# Altium schematic sheet BLE-2541.SchDoc
size A3
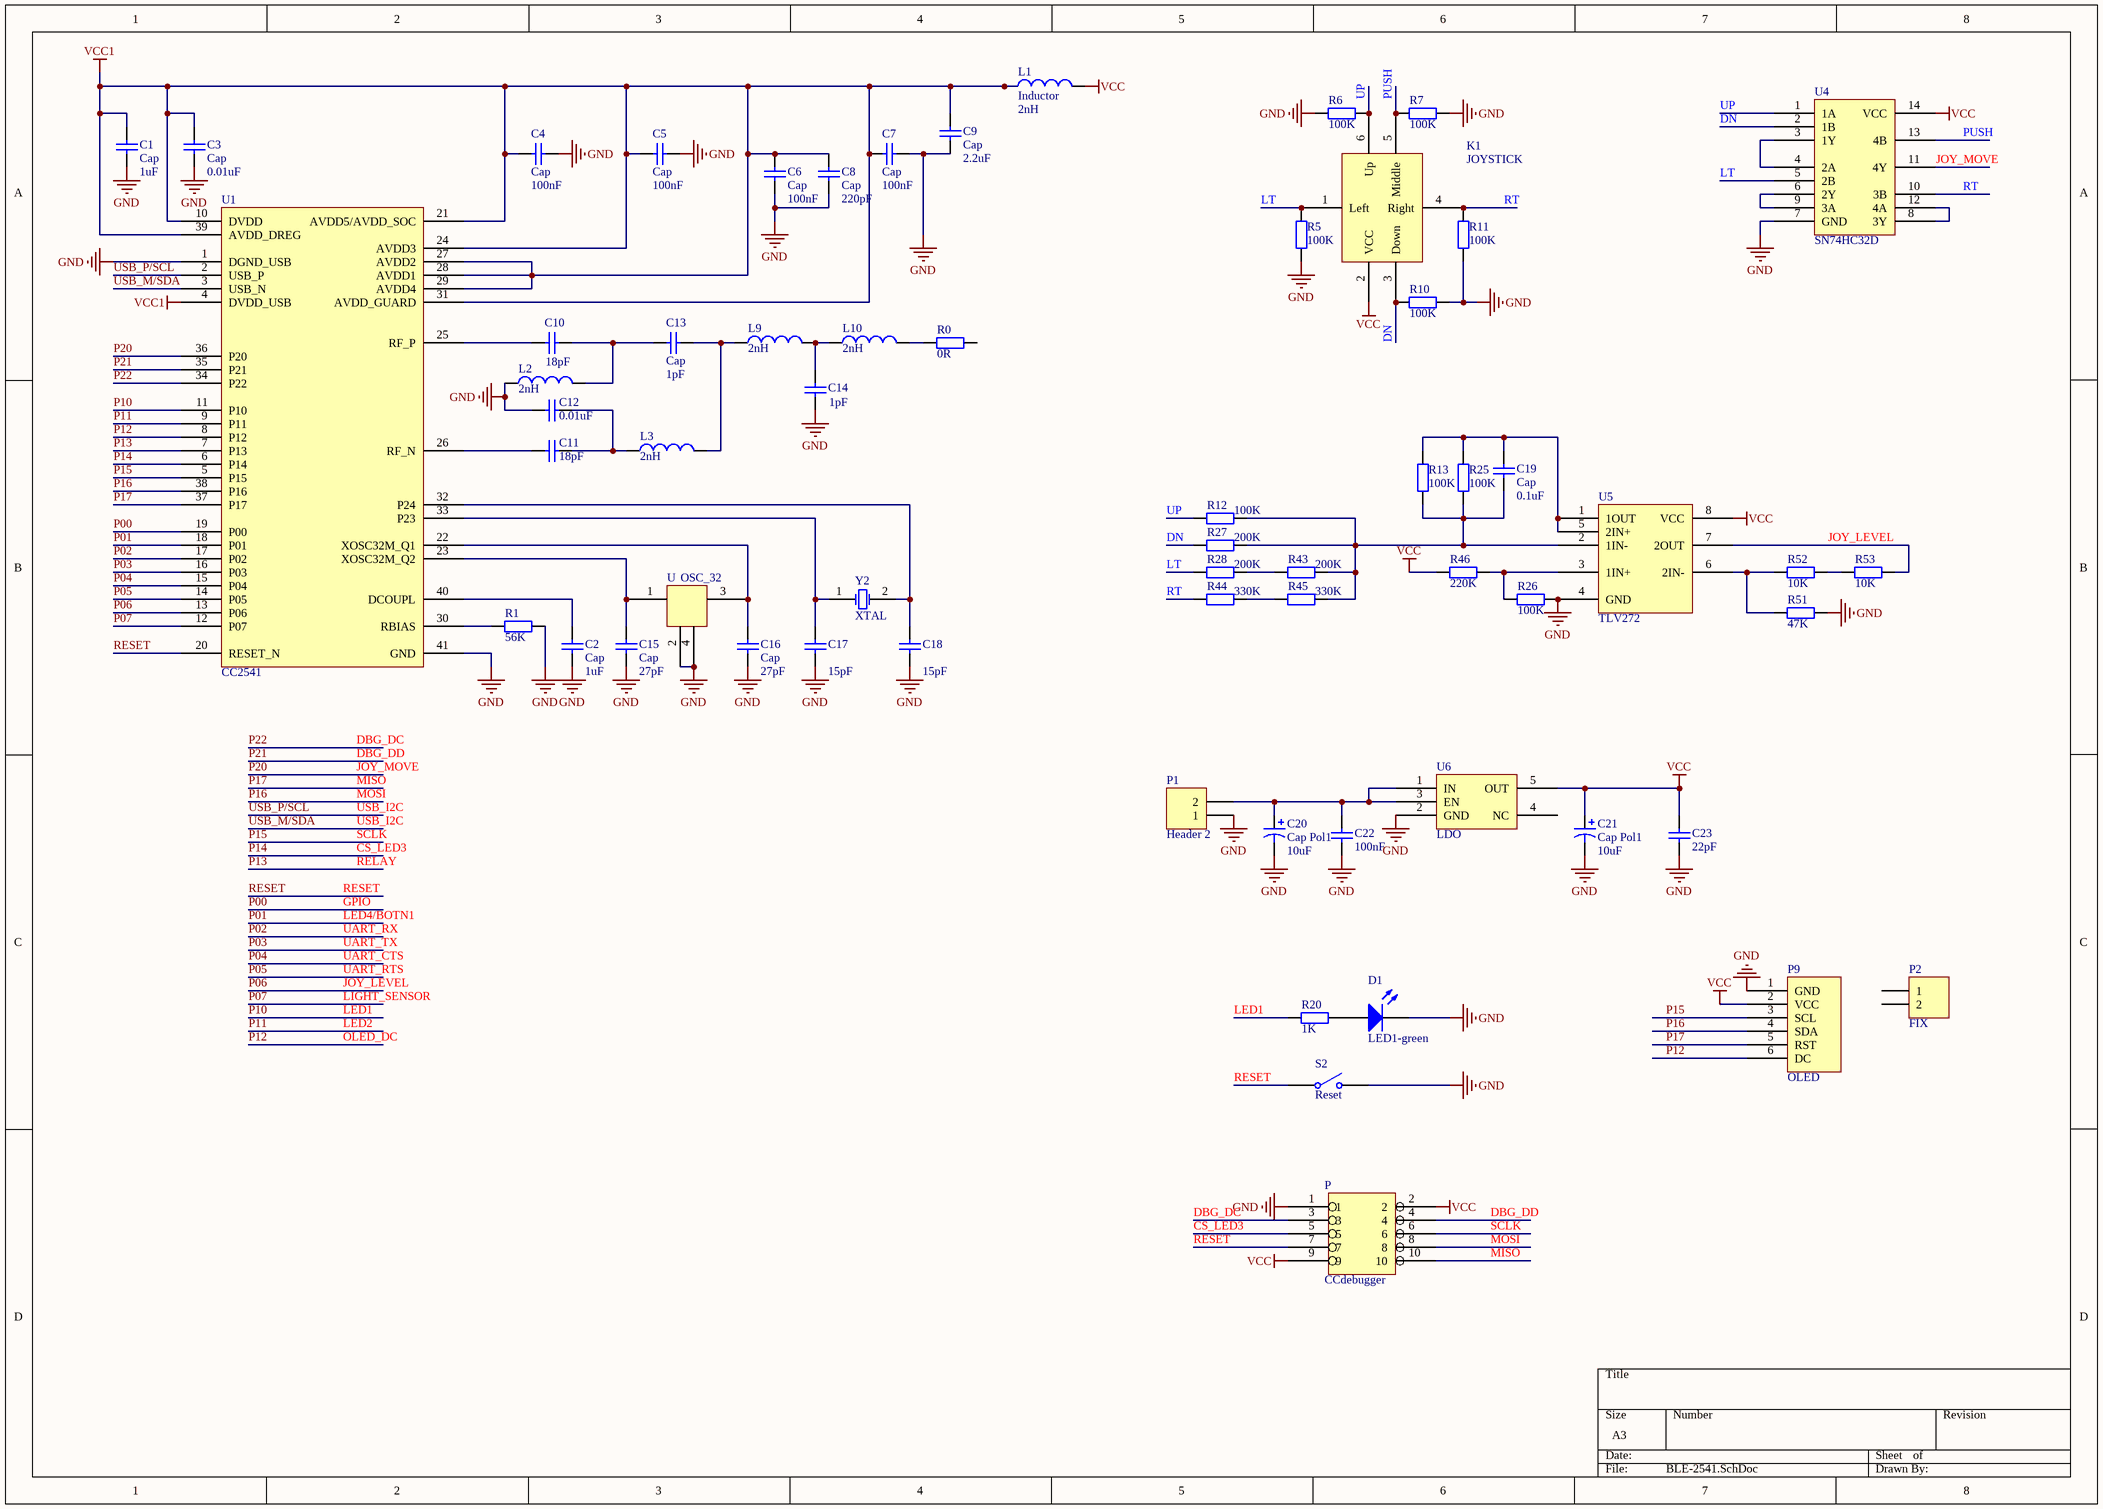
[diagram p0: BLE-2541.SchDoc]

## Parts
C1  Cap  value 1uF  [RAD-0.3]
C2  Cap  value 1uF  [RAD-0.3]
C3  Cap  value 0.01uF  [RAD-0.3]
C4  Cap  value 100nF  [RAD-0.3]
C5  Cap  value 100nF  [RAD-0.3]
C6  Cap  value 100nF  [RAD-0.3]
C7  Cap  value 100nF  [RAD-0.3]
C8  Cap  value 220pF  [RAD-0.3]
C9  Cap  value 2.2uF  [RAD-0.3]
C10  value 18pF  [RAD-0.3]  (hidden comment: Cap)
C11  value 18pF  [RAD-0.3]  (hidden comment: Cap)
C12  value 0.01uF  [RAD-0.3]  (hidden comment: Cap)
C13  Cap  value 1pF  [RAD-0.3]
C14  value 1pF  [RAD-0.3]  (hidden comment: Cap)
C15  Cap  value 27pF  [RAD-0.3]
C16  Cap  value 27pF  [RAD-0.3]
C17  value 15pF  [RAD-0.3]  (hidden comment: Cap)
C18  value 15pF  [RAD-0.3]  (hidden comment: Cap)
C19  Cap  value 0.1uF  [RAD-0.3]
C20  Cap Pol1  value 10uF  [RB7.6-15]
C21  Cap Pol1  value 10uF  [RB7.6-15]
C22  value 100nF  [RAD-0.3]  (hidden comment: Cap)
C23  value 22pF  [RAD-0.3]  (hidden comment: Cap)
D1  LED1-green  [3.2X1.6X1.1]
K1  JOYSTICK
L1  Inductor  value 2nH  [0402-A]
L2  value 2nH  [0402-A]  (hidden comment: Inductor)
L3  value 2nH  [0402-A]  (hidden comment: Inductor)
L9  value 2nH  [0402-A]  (hidden comment: Inductor)
L10  value 2nH  [0402-A]  (hidden comment: Inductor)
P  CCdebugger  [M-IDC10]
P1  Header 2  [HDR1X2]
P2  FIX  [HDR1X2]
P9  OLED  [M-SIP6]
R0  value 0R  [AXIAL-0.4]  (hidden comment: Res2)
R1  value 56K  [AXIAL-0.4]  (hidden comment: Res2)
R5  value 100K  [AXIAL-0.4]  (hidden comment: Res2)
R6  value 100K  [AXIAL-0.4]  (hidden comment: Res2)
R7  value 100K  [AXIAL-0.4]  (hidden comment: Res2)
R10  value 100K  [AXIAL-0.4]  (hidden comment: Res2)
R11  value 100K  [AXIAL-0.4]  (hidden comment: Res2)
R12  value 100K  [AXIAL-0.4]  (hidden comment: Res2)
R13  value 100K  [AXIAL-0.4]  (hidden comment: Res2)
R20  value 1K  [AXIAL-0.4]  (hidden comment: Res2)
R25  value 100K  [AXIAL-0.4]  (hidden comment: Res2)
R26  value 100K  [AXIAL-0.4]  (hidden comment: Res2)
R27  value 200K  [AXIAL-0.4]  (hidden comment: Res2)
R28  value 200K  [AXIAL-0.4]  (hidden comment: Res2)
R43  value 200K  [AXIAL-0.4]  (hidden comment: Res2)
R44  value 330K  [AXIAL-0.4]  (hidden comment: Res2)
R45  value 330K  [AXIAL-0.4]  (hidden comment: Res2)
R46  value 220K  [AXIAL-0.4]  (hidden comment: Res2)
R51  value 47K  [AXIAL-0.4]  (hidden comment: Res2)
R52  value 10K  [AXIAL-0.4]  (hidden comment: Res2)
R53  value 10K  [AXIAL-0.4]  (hidden comment: Res2)
S2  Reset  [SPST-2]
U  OSC_32
U1  CC2541  [CC254x_QFN]
U4  SN74HC32D  [SOIC14]
U5  TLV272  [SOIC8]
U6  LDO
Y2  XTAL  [R38]

## Nets
GND: C1.1 C2.1 C3.1 C4.1 C5.1 C6.2 C7.1 C8.2 C9.2 C12.2 C14.1 C15.1 C16.1 C17.2 C18.2 C20.2 C21.2 C22.1 C23.1 D1.2(K) L2.1 P.1 P1.1 P9.1(GND) R1.2 R5.1 R6.1 R7.2 R10.2 R11.2 R26.2 R51.2 S2.2(NO) U.2 U.4 U1.1(DGND_USB) U1.41(GND) U4.7(GND) U5.4(GND) U6.2(GND)
VCC: C21.1 C23.2 K1.2(VCC) L1.2 P.2 P.9 P9.2(VCC) R46.1 U4.14(VCC) U5.8(VCC) U6.5(OUT)
VCC1: C1.2 C3.2 C4.2 C5.2 C6.1 C7.2 C8.1 C9.1 L1.1 U1.4(DVDD_USB) U1.10(DVDD) U1.21(AVDD5/AVDD_SOC) U1.24(AVDD3) U1.27(AVDD2) U1.28(AVDD1) U1.29(AVDD4) U1.31(AVDD_GUARD) U1.39(AVDD_DREG)
CS_LED3: P.5 U1.6(P14)  [also labelled P14]
DBG_DC: P.3 U1.34(P22)  [also labelled P22]
DBG_DD: P.4 U1.35(P21)  [also labelled P21]
DN: K1.3(Down) R10.1 R27.1 U4.2(1B)
GPIO: U1.19(P00)  [also labelled P00]
JOY_LEVEL: R53.2 U1.13(P06) U5.7(2OUT)  [also labelled P06]
JOY_MOVE: U1.36(P20) U4.11(4Y)  [also labelled P20]
LED1: R20.1 U1.11(P10)  [also labelled P10]
LED2: U1.9(P11)  [also labelled P11]
LED4/BOTN1: U1.18(P01)  [also labelled P01]
LIGHT_SENSOR: U1.12(P07)  [also labelled P07]
LT: K1.1(Left) R5.2 R28.1 U4.5(2B)
MISO: P.10 P9.5(RST) U1.37(P17)  [also labelled P17]
MOSI: P.8 P9.4(SDA) U1.38(P16)  [also labelled P16]
OLED_DC: P9.6(DC) U1.8(P12)  [also labelled P12]
P02: U1.17(P02)  [also labelled UART_RX]
P03: U1.16(P03)  [also labelled UART_TX]
P04: U1.15(P04)  [also labelled UART_CTS]
P05: U1.14(P05)  [also labelled UART_RTS]
P13: U1.7(P13)  [also labelled RELAY]
P15: P.6 P9.3(SCL) U1.5(P15)  [also labelled SCLK]
PUSH: K1.5(Middle) R7.1 U4.13(4B)
RESET: P.7 S2.1(COMMON) U1.20(RESET_N)
RT: K1.4(Right) R11.1 R44.1 U4.10(3B)
UP: K1.6(Up) R6.2 R12.1 U4.1(1A)
USB_I2C: U1.2(USB_P) U1.3(USB_N)  [also labelled USB_M/SDA, USB_P/SCL]
NetC2_2: C2.2 U1.40(DCOUPL)
NetC10_1: C10.1 C13.2 L2.2
NetC10_2: C10.2 U1.25(RF_P)
NetC11_1: C11.1 C12.1 L3.1
NetC11_2: C11.2 U1.26(RF_N)
NetC13_1: C13.1 L3.2 L9.1
NetC14_2: C14.2 L9.2 L10.1
NetC15_2: C15.2 U.1 U1.23(XOSC32M_Q2)
NetC16_2: C16.2 U.3 U1.22(XOSC32M_Q1)
NetC17_1: C17.1 U1.33(P23) Y2.1(OSC1)
NetC18_1: C18.1 U1.32(P24) Y2.2(OSC2)
NetC19_1: C19.1 R12.2 R13.1 R25.1 R27.2 R43.2 R45.2 U5.2(1IN-)
NetC19_2: C19.2 R13.2 R25.2 U5.1(1OUT) U5.5(2IN+)
NetC20_1: C20.1 C22.2 P1.2 U6.1(IN) U6.3(EN)
NetD1_1: D1.1(A) R20.2
NetL10_2: L10.2 R0.1
NetR1_1: R1.1 U1.30(RBIAS)
NetR26_1: R26.1 R46.2 U5.3(1IN+)
NetR28_2: R28.2 R43.1
NetR44_2: R44.2 R45.1
NetR51_1: R51.1 R52.1 U5.6(2IN-)
NetR52_2: R52.2 R53.1
NetU4_3: U4.3(1Y) U4.4(2A)
NetU4_6: U4.6(2Y) U4.9(3A)
NetU4_8: U4.8(3Y) U4.12(4A)

Not connected (* = marked no-connect by the designer): P2 1 2; R0 2; U6 4(NC)

## Library data of the parts
C1-C19 C22 C23 = Cap: Capacitor; Published: 8-Jun-2000; LatestRevisionDate: 17-Jul-2002; LatestRevisionNote: Re-released for DXP Platform.; PackageReference: RAD-0.3; Publisher: Altium Limited; PackageDescription: Radial Cap, Thru-Hole; 2 Leads; 0.3 in Pin Spacing
C20 C21 = Cap Pol1: Polarized Capacitor (Radial); Published: 8-Jun-2000; LatestRevisionDate: 17-Jul-2002; LatestRevisionNote: Re-released for DXP Platform.; PackageReference: RB7.6-15; Publisher: Altium Limited; PackageDescription: Polarized Capacitor (Radial); 2 Leads
D1 = LED2: Typical RED, GREEN, YELLOW, AMBER GaAs LED; Published: 8-Jun-2000; LatestRevisionDate: 17-Jul-2002; LatestRevisionNote: Re-released for DXP Platform.; PackageVersion: Feb-2002; PackageReference: 3.2X1.6X1.1; Publisher: Altium Limited; PackageDescription: SM LED; 2 Flat Leads
L1-L3 L9 L10 = Inductor: Code_IEC: 1005; Published: 8-Jun-2000; LatestRevisionDate: 29-May-2009; LatestRevisionNote: IPC-7351 Footprint Added.; PackageReference: 0402-A; Publisher: Altium Limited; PackageDescription: Chip Inductor; Code_JEITA: 0402
P1 P2 = Header 2: Header, 2-Pin; LatestRevisionDate: 17-Jul-2002; LatestRevisionNote: Re-released for DXP Platform.; Publisher: Altium Limited
R0 R1 R5-R7 R10-R13 R20 R25-R28 R43-R46 R51-R53 = Res2: Resistor; Published: 8-Jun-2000; LatestRevisionDate: 17-Jul-2002; LatestRevisionNote: Re-released for DXP Platform.; PackageReference: AXIAL-0.4; Publisher: Altium Limited; PackageDescription: Axial Device, Thru-Hole; 2 Leads; 0.4 in Pin Spacing
S2 = SW-SPST: Single-Pole, Single-Throw Switch; Published: 24-Mar-1999; LatestRevisionDate: 17-Jul-2002; LatestRevisionNote: Re-released for DXP Platform.; PackageReference: SPST-2; Publisher: Altium Limited; PackageDescription: Switch; 2 Leads
Y2 = XTAL: Crystal Oscillator; Published: 8-Jun-2000; LatestRevisionDate: 17-Jul-2002; LatestRevisionNote: Re-released for DXP Platform.; PackageReference: R38; Publisher: Altium Limited; PackageDescription: Crystal, Thru-Hole; 2 Leads; Body 3.1 x 8.2 mm (Dia.xH)